# EAGLE design main (EAGLE 9.6.1)
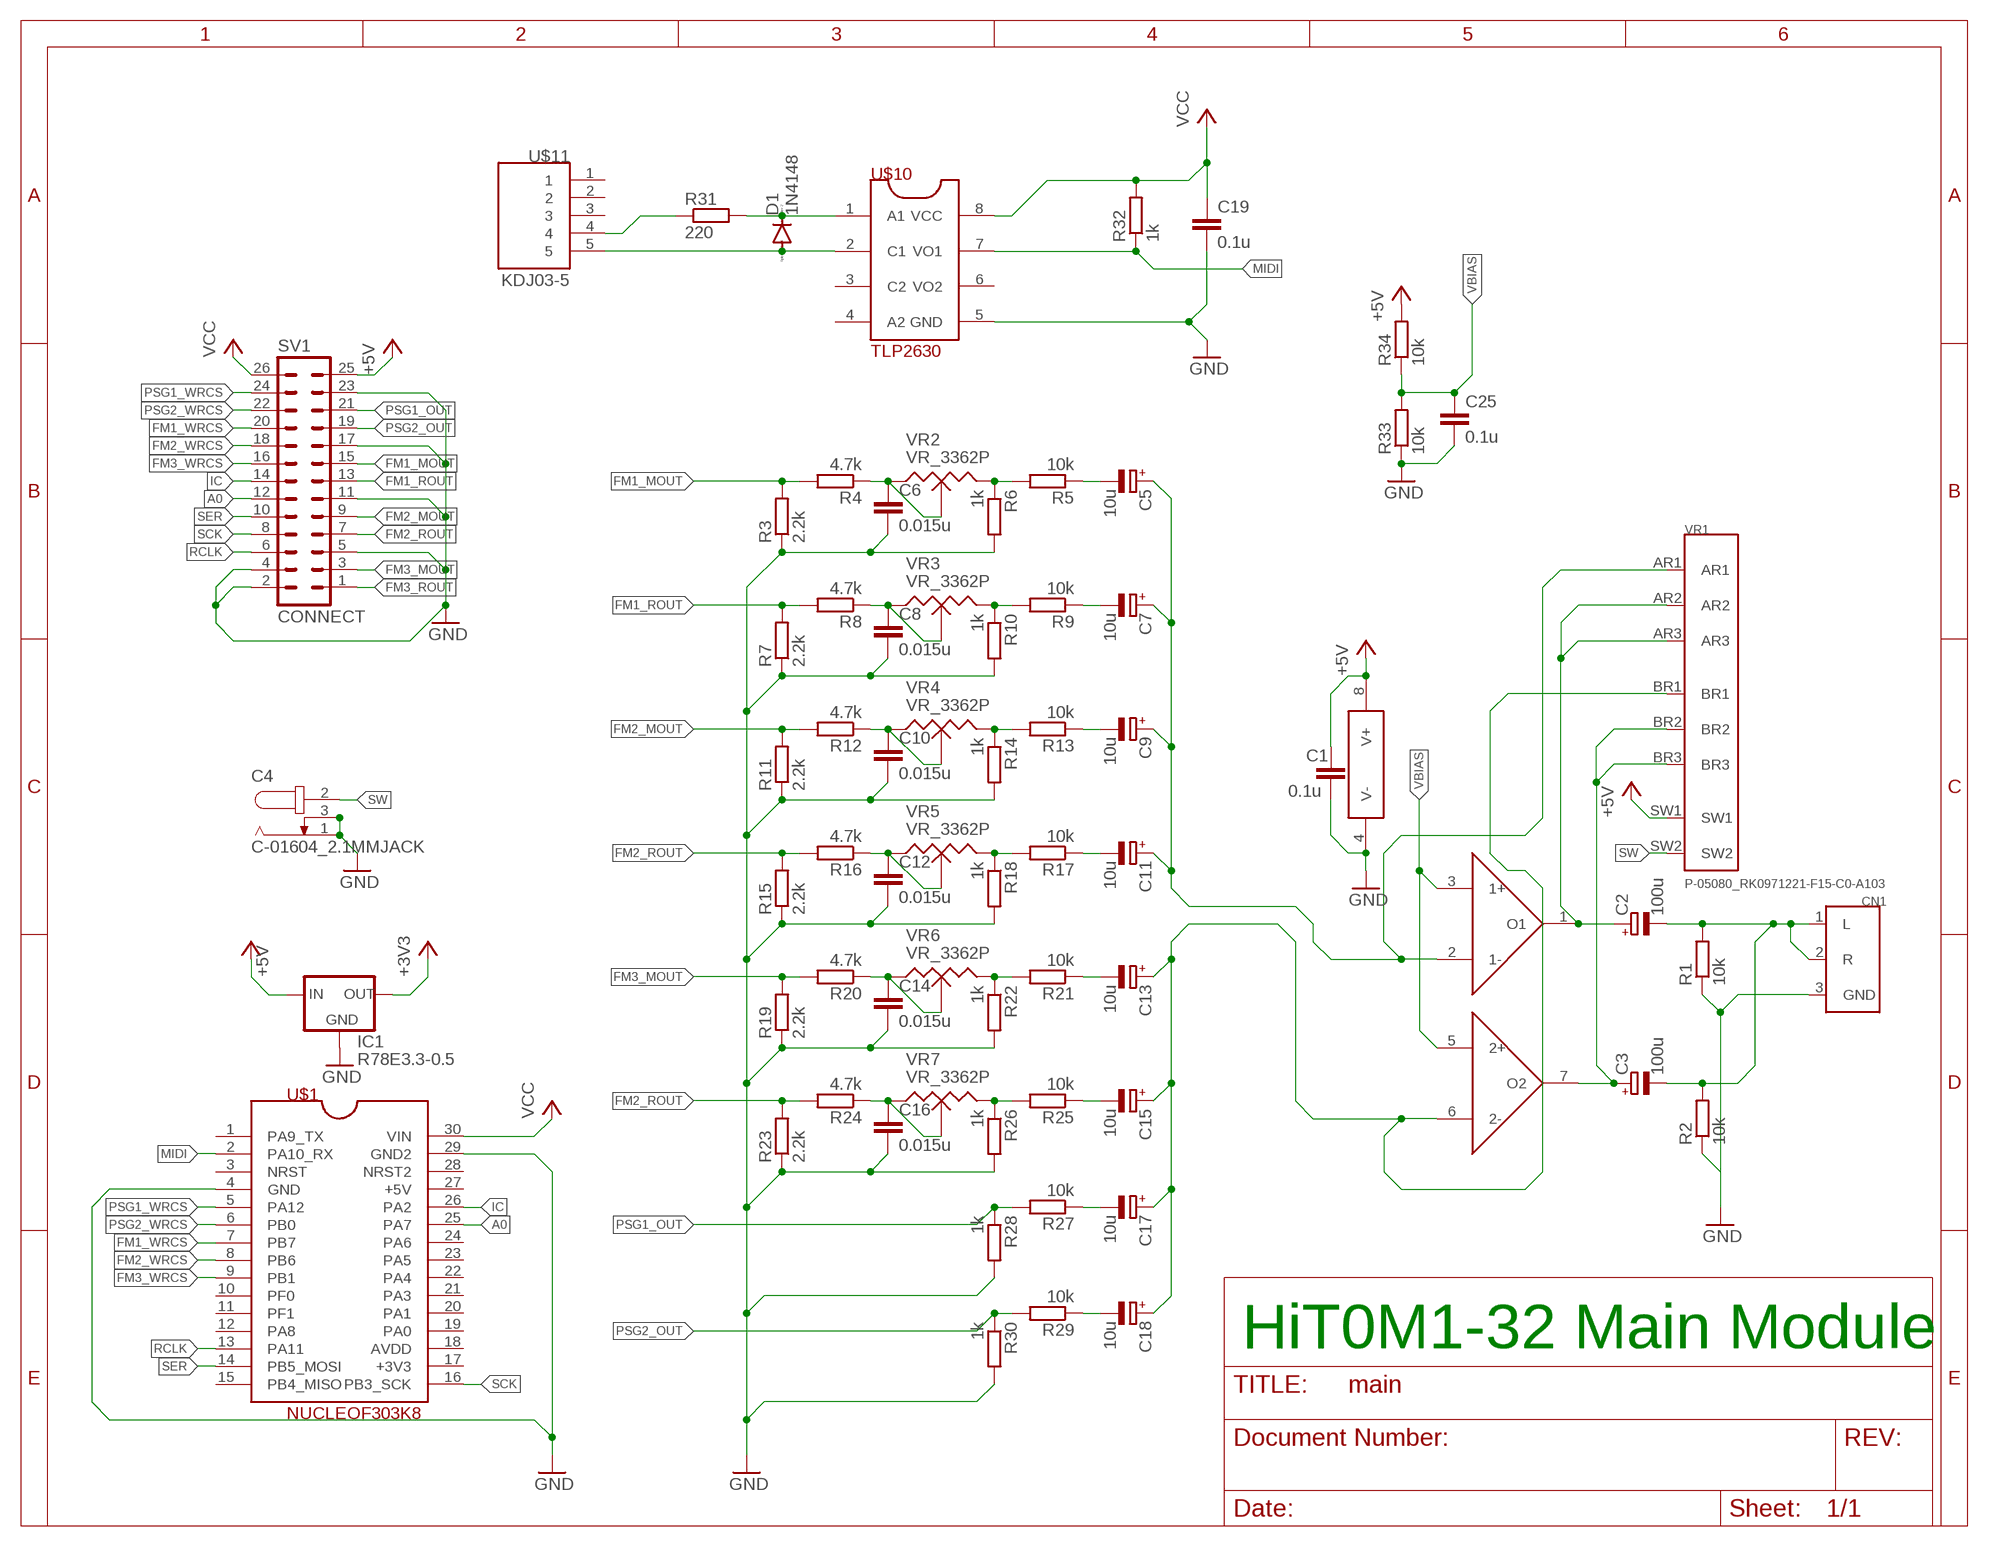
[diagram p0: schematic, sheet 1]

## Parts
C1  0.1u  C-EU025-025X050  [C025-025X050]
C2  100u  CPOL-EUE2,5-6E  [E2,5-6E]
C3  100u  CPOL-EUE2,5-6E  [E2,5-6E]
C4  C-01604_2.1MMJACK  [2.1MMJACK]
C5  10u  CPOL-EUE2,5-6E  [E2,5-6E]
C6  0.015u  C-EU050-025X075  [C050-025X075]
C7  10u  CPOL-EUE2,5-6E  [E2,5-6E]
C8  0.015u  C-EU050-025X075  [C050-025X075]
C9  10u  CPOL-EUE2,5-6E  [E2,5-6E]
C10  0.015u  C-EU050-025X075  [C050-025X075]
C11  10u  CPOL-EUE2,5-6E  [E2,5-6E]
C12  0.015u  C-EU050-025X075  [C050-025X075]
C13  10u  CPOL-EUE2,5-6E  [E2,5-6E]
C14  0.015u  C-EU050-025X075  [C050-025X075]
C15  10u  CPOL-EUE2,5-6E  [E2,5-6E]
C16  0.015u  C-EU050-025X075  [C050-025X075]
C17  10u  CPOL-EUE2,5-6E  [E2,5-6E]
C18  10u  CPOL-EUE2,5-6E  [E2,5-6E]
C19  0.1u  C-EU025-025X050  [C025-025X050]
C25  0.1u  C-EU025-025X050  [C025-025X050]
CN1  C-08958_MJ-352W-0  [MJ-352W-0]
D1  1N4148  1N4148DO35-7  [DO35-7]
IC1  R78E3.3-0.5  78XXS  [78XXS]
R1  10k  R-EU_0204/7  [0204/7]
R2  10k  R-EU_0204/7  [0204/7]
R3  2.2k  R-EU_0204/7  [0204/7]
R4  4.7k  R-EU_0204/7  [0204/7]
R5  10k  R-EU_0204/7  [0204/7]
R6  1k  R-EU_0204/7  [0204/7]
R7  2.2k  R-EU_0204/7  [0204/7]
R8  4.7k  R-EU_0204/7  [0204/7]
R9  10k  R-EU_0204/7  [0204/7]
R10  1k  R-EU_0204/7  [0204/7]
R11  2.2k  R-EU_0204/7  [0204/7]
R12  4.7k  R-EU_0204/7  [0204/7]
R13  10k  R-EU_0204/7  [0204/7]
R14  1k  R-EU_0204/7  [0204/7]
R15  2.2k  R-EU_0204/7  [0204/7]
R16  4.7k  R-EU_0204/7  [0204/7]
R17  10k  R-EU_0204/7  [0204/7]
R18  1k  R-EU_0204/7  [0204/7]
R19  2.2k  R-EU_0204/7  [0204/7]
R20  4.7k  R-EU_0204/7  [0204/7]
R21  10k  R-EU_0204/7  [0204/7]
R22  1k  R-EU_0204/7  [0204/7]
R23  2.2k  R-EU_0204/7  [0204/7]
R24  4.7k  R-EU_0204/7  [0204/7]
R25  10k  R-EU_0204/7  [0204/7]
R26  1k  R-EU_0204/7  [0204/7]
R27  10k  R-EU_0204/7  [0204/7]
R28  1k  R-EU_0204/7  [0204/7]
R29  10k  R-EU_0204/7  [0204/7]
R30  1k  R-EU_0204/7  [0204/7]
R31  220  R-EU_0204/7  [0204/7]
R32  1k  R-EU_0204/7  [0204/7]
R33  10k  R-EU_0204/7  [0204/7]
R34  10k  R-EU_0204/7  [0204/7]
SV1  CONNECT  MA13-2  [MA13-2]
U$1  NUCLEOF303K8  [NUCLEOF303K8]
U$2  NJM2114  [DIL08]
U$10  TLP2630  TLP2630TLP2630  [DIL08]
U$11  KDJ03-5  [KDJ03-5]
VR1  P-05080_RK0971221-F15-C0-A103  [RK0971221-F15-C0-A103]
VR2  VR_3362P  P-03277_VR_3362P  [VR_3362P]
VR3  VR_3362P  P-03277_VR_3362P  [VR_3362P]
VR4  VR_3362P  P-03277_VR_3362P  [VR_3362P]
VR5  VR_3362P  P-03277_VR_3362P  [VR_3362P]
VR6  VR_3362P  P-03277_VR_3362P  [VR_3362P]
VR7  VR_3362P  P-03277_VR_3362P  [VR_3362P]

## Nets
+3V3: IC1.OUT
+5V: C1.1 IC1.IN R34.2 SV1.25 U$2.8(V+) VR1.SW1
A0: SV1.12 U$1.25(PA7)
FM1_MOUT: R3.2 R4.2 SV1.15
FM1_ROUT: R7.2 R8.2 SV1.13
FM1_WRCS: SV1.20 U$1.7(PB7)
FM2_MOUT: R11.2 R12.2 SV1.9
FM2_ROUT: R15.2 R16.2 R23.2 R24.2 SV1.7
FM2_WRCS: SV1.18 U$1.8(PB6)
FM3_MOUT: R19.2 R20.2 SV1.3
FM3_ROUT: SV1.1
FM3_WRCS: SV1.16 U$1.9(PB1)
GND: C1.2 C4.1(GND) C4.3(S) C6.2 C8.2 C10.2 C12.2 C14.2 C16.2 C19.2 C25.2 CN1.3(GND) IC1.GND R1.1 R3.1 R6.2 R7.1 R10.2 R11.1 R14.2 R15.1 R18.2 R19.1 R22.2 R23.1 R26.2 R28.2 R30.2 R33.1 SV1.2 SV1.4 SV1.5 SV1.11 SV1.17 SV1.23 U$1.4(GND) U$1.29(GND2) U$2.4(V-) U$10.5(GND)
IC: SV1.14 U$1.26(PA2)
MIDI: R32.1 U$1.2(PA10_RX) U$10.7(VO1)
MIX_1: C5.+ C7.+ C9.+ C11.+ U$2.2(1-) VR1.AR1
MIX_2: C13.+ C15.+ C17.+ C18.+ U$2.6(2-) VR1.BR1
N$1: D1.C R31.2 U$10.1(A1)
N$3: C2.+ U$2.1(O1) VR1.AR2 VR1.AR3
N$4: R2.1
N$5: C3.+ U$2.7(O2) VR1.BR2 VR1.BR3
N$7: C8.1 R8.1 VR3.1 VR3.2
N$8: D1.A U$10.2(C1) U$11.5
N$11: C6.1 R4.1 VR2.1 VR2.2
N$12: R5.2 R6.1 VR2.3
N$13: C5.- R5.1
N$15: R9.2 R10.1 VR3.3
N$16: C7.- R9.1
N$19: C10.1 R12.1 VR4.1 VR4.2
N$20: R13.2 R14.1 VR4.3
N$21: C9.- R13.1
N$24: C12.1 R16.1 VR5.1 VR5.2
N$25: R17.2 R18.1 VR5.3
N$26: C11.- R17.1
N$29: C14.1 R20.1 VR6.1 VR6.2
N$30: R21.2 R22.1 VR6.3
N$31: C13.- R21.1
N$34: C16.1 R24.1 VR7.1 VR7.2
N$35: R25.2 R26.1 VR7.3
N$36: C15.- R25.1
N$40: C17.- R27.1
N$41: C18.- R29.1
N$43: R31.1 U$11.4
OUT: C2.- C3.- CN1.1(L) CN1.2(R) R1.2 R2.2
PSG1_OUT: R27.2 R28.1 SV1.21
PSG1_WRCS: SV1.24 U$1.5(PA12)
PSG2_OUT: R29.2 R30.1 SV1.19
PSG2_WRCS: SV1.22 U$1.6(PB0)
RCLK: SV1.6 U$1.13(PA11)
SCK: SV1.8 U$1.16(PB3_SCK)
SER: SV1.10 U$1.14(PB5_MOSI)
SW: C4.2(VCC) VR1.SW2
VBIAS: C25.1 R33.2 R34.1 U$2.3(1+) U$2.5(2+)
VCC: C19.1 R32.2 SV1.26 U$1.30(VIN) U$10.8(VCC)
Unconnected: U$1.1(PA9_TX) U$1.3(NRST) U$1.10(PF0) U$1.11(PF1) U$1.12(PA8) U$1.15(PB4_MISO) U$1.17(+3V3) U$1.18(AVDD) U$1.19(PA0) U$1.20(PA1) U$1.21(PA3) U$1.22(PA4) U$1.23(PA5) U$1.24(PA6) U$1.27(+5V) U$1.28(NRST2) U$10.3(C2) U$10.4(A2) U$10.6(VO2) U$11.1 U$11.2 U$11.3

## Notes on the sheet
- HiT0M1-32 Main Module

## Library data of the parts
C1 C6 C8 C10 C12 C14 C16 C19 C25 = rcl:C-EU: CAPACITOR, European symbol; SPICEPREFIX: C
C2 C3 C5 C7 C9 C11 C13 C15 C17 C18 = rcl:CPOL-EU: POLARIZED CAPACITOR, European symbol; SPICEPREFIX: C
C4 = Akizuki:C-01604_2.1MMJACK
CN1 = Akizuki:C-08958_MJ-352W-0
D1 = diode:1N4148: DIODE high speed (Philips)
IC1 = v-reg:78XXS: VOLTAGE REGULATOR
R1-R34 = rcl:R-EU_: RESISTOR, European symbol; SPICEPREFIX: R
SV1 = con-lstb:MA13-2: PIN HEADER; OC_FARNELL: unknown; OC_NEWARK: unknown
U$1 = midi:NUCLEOF303K8
U$2 = midi:NJM2114
U$10 = midi:TLP2630
U$11 = midi:KDJ03-5
VR1 = Akizuki:P-05080_RK0971221-F15-C0-A103
VR2-VR7 = Akizuki:P-03277_VR_3362P

## Net classes
0 default: width 1.143 mm, clearance 0.254 mm

## Board
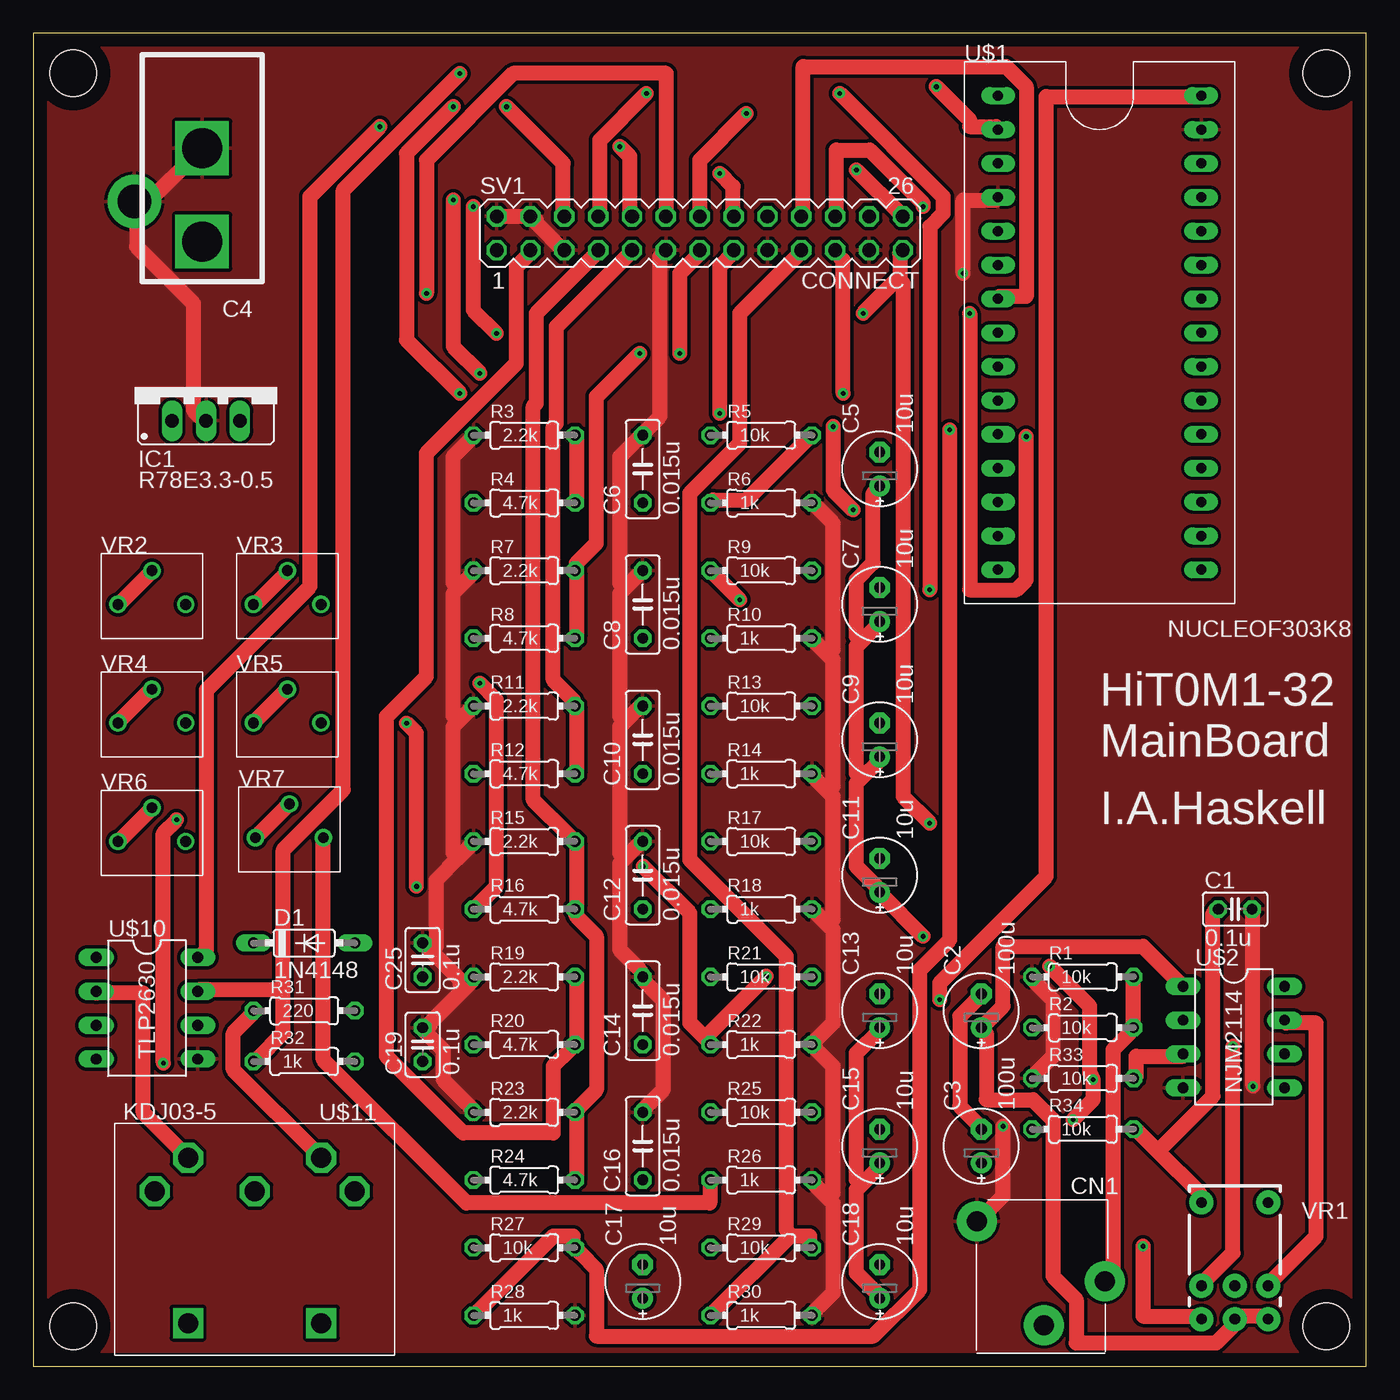
[diagram p1: board, top side]
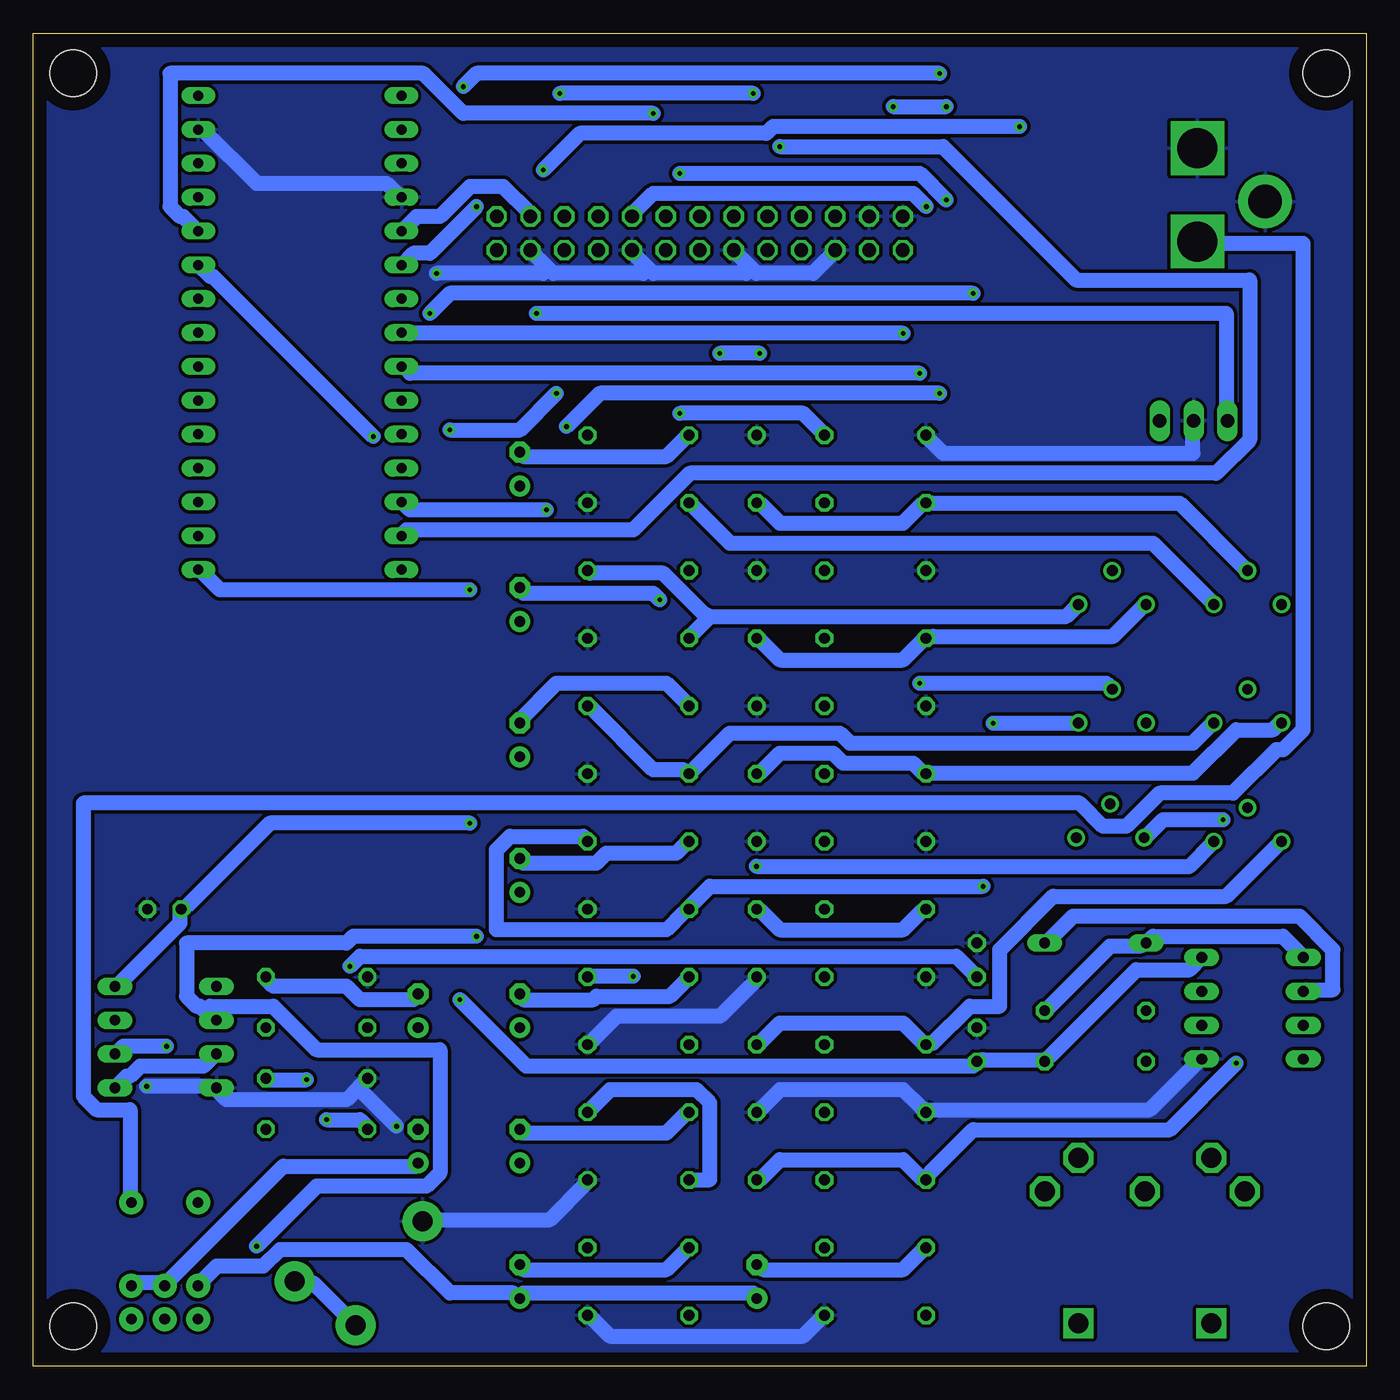
[diagram p2: board, bottom side, seen from below]

Size 100 x 100 mm. Coordinates in mm from the lower left corner, seen from the top.
Outline: 0,0 100,0 100,100 0,100 0,0
Copper layers (1*16): Top 0.035mm / dielectric 1.5mm / Bottom 0.035mm
Design rules "default": minimum track width 6mil, minimum drill 0.35mm, track to track 6mil, track to pad 6mil, pad to pad 6mil, via to via 6mil, smd to smd 6mil, copper to edge 40mil, drill to drill 6mil, minimum pad ring 10mil, minimum via ring 8mil, stop-mask expansion 4mil, vias tented up to drill 0mil, thermal gap 10mil
Holes 3.5 mm at 3,97 3,3 97,3 97,97

### Footprints (pad centres in the part's own frame; a part is rotated, then mirrored left to right if it is on the bottom)
C025-025X050 = drill 0.813 octagon: 1 -1.27,0; 2 1.27,0
E2,5-6E = drill 0.813 pad 1.575: + -1.27,0 | drill 0.813 pad 1.575 octagon: - 1.27,0
2.1MMJACK = drill 3 pad 3.3 square: 1 0,0; 2 0,7 | drill 2.5 pad 4: 3 5.082,4
C050-025X075 = drill 0.813 octagon: 1 -2.54,0; 2 2.54,0
MJ-352W-0 = drill 1.5 pad 3: 1 0,0; 2 4.55,3.3; 3 -5.05,7.8
DO35-7 = drill 0.813 long: A 3.81,0; C -3.81,0
78XXS = drill 1.016 long: GND 0,-2.54; IN -2.54,-2.54; OUT 2.54,-2.54
0204/7 = drill 0.813 octagon: 1 -3.81,0; 2 3.81,0
MA13-2 = drill 1.016 octagon: 1 -15.24,-1.27; 2 -15.24,1.27; 3 -12.7,-1.27; 4 -12.7,1.27; 5 -10.16,-1.27; 6 -10.16,1.27; 7 -7.62,-1.27; 8 -7.62,1.27; 9 -5.08,-1.27; 10 -5.08,1.27; 11 -2.54,-1.27; 12 -2.54,1.27; 13 0,-1.27; 14 0,1.27; 15 2.54,-1.27; 16 2.54,1.27; 17 5.08,-1.27; 18 5.08,1.27; 19 7.62,-1.27; 20 7.62,1.27; 21 10.16,-1.27; 22 10.16,1.27; 23 12.7,-1.27; 24 12.7,1.27; 25 15.24,-1.27; 26 15.24,1.27
NUCLEOF303K8 = drill 0.75 long: 1 -7.62,20.32; 2 -7.62,17.78; 3 -7.62,15.24; 4 -7.62,12.7; 5 -7.62,10.16; 6 -7.62,7.62; 7 -7.62,5.08; 8 -7.62,2.54; 9 -7.62,0; 10 -7.62,-2.54; 11 -7.62,-5.08; 12 -7.62,-7.62; 13 -7.62,-10.16; 14 -7.62,-12.7; 15 -7.62,-15.24; 16 7.62,-15.24; 17 7.62,-12.7; 18 7.62,-10.16; 19 7.62,-7.62; 20 7.62,-5.08; 21 7.62,-2.54; 22 7.62,0; 23 7.62,2.54; 24 7.62,5.08; 25 7.62,7.62; 26 7.62,10.16; 27 7.62,12.7; 28 7.62,15.24; 29 7.62,17.78; 30 7.62,20.32
DIL08 = drill 0.813 long: 1 -3.81,-3.81; 2 -1.27,-3.81; 3 1.27,-3.81; 4 3.81,-3.81; 5 3.81,3.81; 6 1.27,3.81; 7 -1.27,3.81; 8 -3.81,3.81
KDJ03-5 = drill 1.5 octagon: 1 -7.5,-9.9; 2 0,-9.9; 3 7.5,-9.9; 4 -5,-12.4; 5 5,-12.4 | drill 1.5 square: M1 -5,0; M2 5,0
RK0971221-F15-C0-A103 = drill 0.8 pad 1.8: AR1 -2.5,0; AR2 0,0; AR3 2.5,0; BR1 -2.5,2.5; BR2 0,2.5; BR3 2.5,2.5; SW1 -2.5,8.75; SW2 2.5,8.75
VR_3362P = drill 0.8: 1 0,0; 2 2.54,2.54; 3 5.08,0

### Placement (x,y rotation side)
C1  90.17,34.29 0 top
C2  71.12,26.67 90 top
C3  71.12,16.51 90 top
C4  12.66,91.38 180 top
C5  63.5,67.31 90 top
C6  45.72,67.31 90 top
C7  63.5,57.15 90 top
C8  45.72,57.15 90 top
C9  63.5,46.99 90 top
C10  45.72,46.99 90 top
C11  63.5,36.83 90 top
C12  45.72,36.83 90 top
C13  63.5,26.67 90 top
C14  45.72,26.67 90 top
C15  63.5,16.51 90 top
C16  45.72,16.51 90 top
C17  45.72,6.35 90 top
C18  63.5,6.35 90 top
C19  29.21,24.13 90 top
C25  29.21,30.48 90 top
CN1  75.83,3.08 0 top
D1  20.32,31.75 0 top
IC1  12.95,73.47 0 top
R1  78.74,29.21 0 top
R2  78.74,25.4 0 top
R3  36.83,69.85 0 top
R4  36.83,64.77 0 top
R5  54.61,69.85 0 top
R6  54.61,64.77 0 top
R7  36.83,59.69 0 top
R8  36.83,54.61 0 top
R9  54.61,59.69 0 top
R10  54.61,54.61 0 top
R11  36.83,49.53 0 top
R12  36.83,44.45 0 top
R13  54.61,49.53 0 top
R14  54.61,44.45 0 top
R15  36.83,39.37 0 top
R16  36.83,34.29 0 top
R17  54.61,39.37 0 top
R18  54.61,34.29 0 top
R19  36.83,29.21 0 top
R20  36.83,24.13 0 top
R21  54.61,29.21 0 top
R22  54.61,24.13 0 top
R23  36.83,19.05 0 top
R24  36.83,13.97 0 top
R25  54.61,19.05 0 top
R26  54.61,13.97 0 top
R27  36.83,8.89 0 top
R28  36.83,3.81 0 top
R29  54.61,8.89 0 top
R30  54.61,3.81 0 top
R31  20.32,26.67 0 top
R32  20.32,22.86 0 top
R33  78.74,21.59 0 top
R34  78.74,17.78 0 top
SV1  50,85 0 top
U$1  80,75 0 top
U$2  90.07,24.69 270 top
U$10  8.53,26.85 270 top
U$11  16.61,3.22 180 top
VR1  90.14,3.53 0 top
VR2  6.35,57.15 0 top
VR3  16.51,57.15 0 top
VR4  6.35,48.26 0 top
VR5  16.51,48.26 0 top
VR6  6.35,39.37 0 top
VR7  16.67,39.64 0 top

### Tracks (layer width: path | path; a pad name or v marks a point on that pad's centre or on a via)
+5V  (via drill 0.35)
  Top 1.143: 84.38,16.12 87.5,13 87.5,12.5 VR1.SW1 | 84.38,16.12 82.75,17.75 R34.2 | 84.38,16.12 88.5,20.25 88.5,34 88.75,34.25 C1.1 | 64.88,81.62 65,81.75 65,83.5 SV1.25 | 64.88,81.62 v62.25,79 | v67.25,40.75 65.25,42.75 65.25,81.25 64.88,81.62
  Bottom 1.143: U$2.8 93.75,28.5 89,33.25 89,34.25 C1.1 88.5,34.5 82.25,40.75 v67.25,40.75 | v62.25,79 10.5,79 10.5,71 IC1.IN
A0  (via drill 0.35)
  Top 1.143: v74.5,69.75 74.5,59 73.75,58.25 70.25,58.25 v70.25,79 | v29.5,80.5 29.5,90.5 36,97 47.5,97 47.5,86.5 SV1.12
  Bottom 1.143: U$1.25 86.75,81.75 86.5,81.75 v74.5,69.75 | v70.25,79 68.75,80.5 v29.5,80.5
FM1_MOUT  (via drill 0.35)
  Top 1.143: R4.2 40.75,65 40.75,69.75 R3.2 | v51.5,71.5 51.5,82.5 52.5,83.5 SV1.15
  Bottom 1.143: v51.5,71.5 42.25,71.5 40.75,70 R3.2
FM1_ROUT  (via drill 0.35)
  Top 1.143: R8.2 40.75,54.75 40.75,59.5 R7.2 40.75,60.25 42.25,61.75 42.25,72.75 v45.5,76 | v48.5,76 48.5,82 50,83.5 SV1.13
  Bottom 1.143: v45.5,76 v48.5,76
FM1_WRCS
  Top 1.143: U$1.7 72.5,80.25 74.5,80.25 74.5,96 73,97.5 57.75,97.5 57.75,86.5 SV1.20
FM2_MOUT
  Top 1.143: R12.2 40.75,44.5 40.75,49.5 R11.2 40.5,50 39,51.5 39,70.5 39.25,70.75 39.25,78 44.75,83.5 SV1.9
FM2_ROUT
  Top 1.143: R24.2 40.75,14 40.75,19 R23.2 41,19.5 42.25,20.75 42.25,32.25 40.75,33.75 R16.2 40.75,34.5 40.75,39.25 R15.2 40.25,39.75 37.5,42.5 37.5,72 37.75,72.25 37.75,79 42.25,83.5 SV1.7
FM2_WRCS  (via drill 0.35)
  Top 1.143: v34.75,77.5 33,79.25 v33,87
  Bottom 1.143: v34.75,77.5 72.25,77.5 U$1.8 | v33,87 34,88 53.5,88 55,86.5 SV1.18
FM3_MOUT
  Top 1.143: R19.2 40.75,29 40.75,24.25 R20.2 40.25,23.75 39,22.5 39,17.5 32.25,17.5 26.5,23.25 26.5,48.75 29.5,51.75 29.5,68.5 36.25,75.25 36.25,82.5 37.25,83.5 SV1.3
FM3_WRCS  (via drill 0.35)
  Top 1.143: v33.5,74.5 31.5,76.5 v31.5,87.5 | v51.5,89.5 52.5,88.5 52.5,86.5 SV1.16
  Bottom 1.143: v33.5,74.5 71.75,74.5 72.25,75 U$1.9 | v31.5,87.5 33.5,89.5 v51.5,89.5
GND  (via drill 0.35)
  Top 1.143: 59.62,33.12 58.5,34.25 R18.2 | 59.62,33.12 60,32.75 60,25.75 58.5,24.25 R22.2 58.75,23.75 60,22.5 60,13 59.62,12.62 | 59.62,43.12 60,42.75 60,33.5 59.62,33.12 | 59.62,43.12 58.5,44.25 R14.2 | 59.62,53.38 60,53 60,43.5 59.62,43.12 | 59.62,53.38 58.5,54.5 R10.2 | R6.2 58.5,64.75 60,63.25 60,53.75 59.62,53.38 | R33.1 75,21.75 76.5,23.25 76.5,27.5 75,29 R1.1 | v91.5,21 91.5,34.25 C1.2 | 59.62,12.62 58.5,13.75 R26.2 | 59.62,12.62 60,12.25 60,5.5 58.5,4 R30.2 | v72.75,18 72.75,12.75 71,11 CN1.3 | SV1.2 35,86.25 37.25,86.25 SV1.4 37.75,86 37.75,85.75 39.75,83.75 SV1.5 | v69.75,82 69.75,87.5 72.25,87.5 U$1.4 | C16.2 45.75,19.25 47.25,20.75 47.25,27.5 45.75,29 C14.2 45.5,29.75 44,31.25 44,37.75 44.38,38.12 | 44.38,38.12 45.5,39.25 C12.2 | 44.38,48.38 44,48 44,38.5 44.38,38.12 | 44.38,48.38 45.5,49.5 C10.2 | 44.38,58.38 44,58 44,48.75 44.38,48.38 | 44.38,58.38 45.5,59.5 C8.2 | 44.38,58.38 44,58.75 44,68.25 45.5,69.75 C6.2 46,70.25 47,71.25 47,83.25 47.25,83.5 SV1.11 | IC1.GND 12.75,71 12,71.75 12,79.75 7.75,84 7.75,87.25 C4.3 8.25,87 12.5,91.25 C4.1 | R23.1 33,19.25 30.75,21.5 30.75,23.75 29.25,25.25 C19.2 29.75,25.5 29.75,25.75 32.38,28.38 | 32.38,28.38 33,29 R19.1 | 29.88,31.12 32,29 32,28.75 32.38,28.38 | 29.88,31.12 29.25,31.75 C25.2 | 31.88,38.12 30.25,36.5 30.25,31.5 29.88,31.12 | 31.88,38.12 33,39.25 R15.1 | 31.88,48.38 31.5,48 31.5,38.5 31.88,38.12 | 31.88,48.38 33,49.5 R11.1 | 31.88,58.38 31.5,58 31.5,48.75 31.88,48.38 | 31.88,58.38 33,59.5 R7.1 | R3.1 33,69.75 31.5,68.25 31.5,58.75 31.88,58.38
  Bottom 1.143: 75.62,20.88 75,21.5 R33.1 | 75.62,20.88 76.5,20 85.5,20 86.25,20.75 U$2.4 86.75,21 v91.5,21 | R28.2 40.75,3.75 42.25,2.25 56.75,2.25 58.25,3.75 R30.2 | R26.2 58.5,13.75 61.25,11 70.75,11 CN1.3 | v72.75,18 75.62,20.88 | U$1.4 72.5,87.75 73.5,88.75 83.25,88.75 87.25,92.75 87.5,92.75 U$1.29 | 46.12,82.38 45.75,82 41.5,82 40,83.5 SV1.5 | 46.12,82.38 47.25,83.5 SV1.11 | 53.88,82.38 53.5,82 46.5,82 46.12,82.38 | 53.88,82.38 55,83.5 SV1.17 | 61.38,82.38 61,82 54.25,82 53.88,82.38 | 61.38,82.38 62.5,83.5 SV1.23 | v69.75,82 61.75,82 61.38,82.38 | U$10.5 12.5,23 16.25,19.25 33,19.25 R23.1 33.5,19.5 34.75,20.75 44,20.75 45.5,19.25 C16.2 | IC1.GND 13,70.75 13,68.5 31.75,68.5 33,69.75 R3.1 | R22.2 58.25,24.25 56.25,26.25 48.5,26.25 45.75,29 C14.2
  pour Top: 0,0 0,100.33 100.33,100.33 100.33,0
  pour Bottom: 0,0 0,100.33 100.33,100.33 100.33,0
IC  (via drill 0.35)
  Top 1.143: v53.5,94 50,90.5 SV1.14
  Bottom 1.143: v53.5,94 67.75,94 70.75,97 89.75,97 89.75,87 89,86.25 88.75,86.25 87.75,85.25 U$1.26
MIDI  (via drill 0.35)
  Top 1.143: v67.75,96 70.25,93.5 70.25,93 72.25,93 U$1.2 | v32,97 23.25,88.25 23.25,43.25 18.75,38.75 18.75,28.25 | 18.75,28.25 18.75,25 16.75,23 R32.1 | 18.75,28.25 12.5,28.25 U$10.7
  Bottom 1.143: v67.75,96 66.75,97 v32,97
MIX_1  (via drill 0.35)
  Top 1.143: v66.75,32.25 63.5,35.5 C11.+ 63.25,36 61.75,37.5 61.75,43.75 62.12,44.12 | 62.12,44.12 63.5,45.5 C9.+ | 62.12,54.38 61.75,54 61.75,44.5 62.12,44.12 | 62.12,54.38 63.5,55.75 C7.+ | C5.+ 63.5,66 63,65.5 63,60.25 61.75,59 61.75,54.75 62.12,54.38 | v83.25,9 83.25,3.75 87.5,3.75 VR1.AR1
  Bottom 1.143: 87.12,26.62 87.5,27 87.75,27 88.5,27.75 88.5,31.75 76.5,31.75 76,32.25 v66.75,32.25 | 87.12,26.62 86.5,26 U$2.2 | v83.25,9 78.75,13.5 70.5,13.5 69.5,14.5 69.5,23.75 78.75,23.75 82,27 86.75,27 87.12,26.62
MIX_2  (via drill 0.35)
  Top 1.143: v90,24 90,8.5 87.75,6.25 VR1.BR1 | 62.12,13.62 61.75,13.25 61.75,7 63.5,5.25 C18.+ | 62.12,13.62 63.5,15 C15.+ | C13.+ 63.5,25.25 61.75,23.5 61.75,14 62.12,13.62
  Bottom 1.143: v90,24 93.25,24 93.75,23.5 U$2.6 | C17.+ 45.75,5.25 46,5.5 63.25,5.5 63.5,5.25 C18.+ 64,5.5 68.75,5.5 72,8.75 81.5,8.75 82.75,7.5 86.25,7.5 87.5,6.25 VR1.BR1
N$1
  Bottom 1.143: U$10.1 4.75,30.75 6.25,32.25 16,32.25 D1.C 17,31.5 19.25,31.5 24,26.75 R31.2
N$3
  Top 1.143: VR1.AR3 92.5,3.75 90.25,3.75 VR1.AR2 90,3 88.75,1.75 78.25,1.75 78.25,5 76.5,6.75 76.5,18.5 75,20 71.5,20 71.5,25 C2.+ 71.25,25.5 72.75,27 72.75,31.5 83.25,31.5 U$2.1
N$5
  Top 1.143: U$2.7 94,25.75 96.25,25.75 96.25,9.75 92.75,6.25 VR1.BR3
  Bottom 1.143: C3.+ 71.25,15 81.25,15 90,6.25 VR1.BR2 90.5,6.25 92.5,6.25 VR1.BR3
N$7
  Top 1.143: VR3.1 16.75,57.25 19,59.5 VR3.2
  Bottom 1.143: C8.1 45.5,54.5 44,53 34.75,53 33.25,54.5 R8.1 32.5,54.75 19,54.75 16.75,57 VR3.1
N$8
  Top 1.143: U$10.2 4.75,28 8.25,28 8.25,19 11.5,15.75 U$11.5
  Bottom 1.143: D1.A 24,31.75 22,33.75 5,33.75 2.5,31.25 2.5,28.25 4.5,28.25 U$10.2
N$11
  Top 1.143: VR2.1 6.5,57.25 8.75,59.5 VR2.2
  Bottom 1.143: C6.1 45.5,64.75 44,63.25 34.75,63.25 33.25,64.75 R4.1 32.5,64.75 14,64.75 9,59.75 VR2.2
N$12
  Top 1.143: R5.2 58.25,69.75 53.5,65 51,65 R6.1
  Bottom 1.143: VR2.3 11.5,57.25 16,61.75 47.75,61.75 50.75,64.75 R6.1
N$13
  Bottom 1.143: R5.1 51,69.75 52.5,68.25 63.25,68.25 63.5,68.5 C5.-
N$15
  Bottom 1.143: 49.25,56.25 22.5,56.25 21.75,57 VR3.3 | 49.25,56.25 50.75,54.75 R10.1 | R9.2 58.25,59.5 52.75,59.5 49.75,56.5 49.25,56.25
N$16  (via drill 0.35)
  Top 1.143: v53,57.5 51,59.5 R9.1
  Bottom 1.143: v53,57.5 53.5,58 63.25,58 63.5,58.25 C7.-
N$19
  Top 1.143: VR4.1 6.5,48.5 8.75,50.75 VR4.2
  Bottom 1.143: C10.1 45.5,44.5 44,46 40,46 39.25,45.25 34,45.25 33.25,44.5 R12.1 32.5,44.5 13,44.5 9.75,47.75 7,47.75 6.5,48.25 VR4.1
N$20
  Bottom 1.143: VR4.3 11.5,48.25 13,46.75 38.75,46.75 39.5,47.5 47.75,47.5 R14.1 51.25,44.75 53.5,44.75 58.25,49.5 R13.2
N$21
  Bottom 1.143: R13.1 51,49.75 52.5,51.25 60.75,51.25 63.5,48.5 C9.-
N$24  (via drill 0.35)
  Top 1.143: VR5.2 VR5.1 | v33.5,51.25 34.75,50 34.75,36 33.25,34.5 R16.1
  Bottom 1.143: R16.1 33.25,34.25 34.75,32.75 44,32.75 45.5,34.25 C12.1 | VR5.2 19.5,51.25 v33.5,51.25
N$25  (via drill 0.35)
  Top 1.143: v28,48.25 28.75,47.5 v28.75,36
  Bottom 1.143: v28,48.25 21.75,48.25 VR5.3 | v28.75,36 49.25,36 50.75,34.5 R18.1 51.25,34 52.5,32.75 65.25,32.75 65.25,38.75 64.25,39.75 58.75,39.75 58.5,39.5 R17.2
N$26
  Bottom 1.143: R17.1 51,39.25 51.75,38.5 57,38.5 57.75,37.75 63.25,37.75 63.5,38 C11.-
N$29
  Top 1.143: VR6.1 6.5,39.5 8.75,41.75 VR6.2
  Bottom 1.143: C14.1 45.5,24.25 44,25.75 34.75,25.75 33.25,24.25 R20.1 32.5,24.25 29.75,27 27.5,27 27.5,31.25 23.5,35.25 10.5,35.25 6.5,39.25 VR6.1
N$30  (via drill 0.35)
  Top 1.143: v45.75,37.5 49.25,34 49.25,25.75 50.38,24.62 | 50.38,24.62 50.75,24.25 R22.1 | 50.38,24.62 v55,29.25
  Bottom 1.143: v45.75,37.5 13.25,37.5 11.5,39.25 VR6.3 | v55,29.25 58.25,29.25 R21.2
N$31
  Bottom 1.143: R21.1 51,29 52.25,27.75 57.75,27.75 58,27.5 63.25,27.5 63.5,27.75 C13.-
N$34  (via drill 0.35)
  Top 1.143: VR7.1 16.75,39.75 19,42 VR7.2 | v10.75,41 9.75,40 v9.75,22.75
  Bottom 1.143: C16.1 45.5,14 44,15.5 34.75,15.5 33.25,14 R24.1 32.75,14.5 29.5,17.75 14.75,17.75 v9.75,22.75 | v10.75,41 15.25,41 16.5,39.75 VR7.1
N$35
  Top 1.143: VR7.3 21.75,23 32.5,12.25 50.75,12.25 50.75,13.75 R26.1
  Bottom 1.143: R25.2 58.25,19.25 56.75,20.75 50.25,20.75 49.25,19.75 49.25,14 50.75,14 R26.1
N$36
  Bottom 1.143: R25.1 51,19 52.5,17.5 63.25,17.5 63.5,17.75 C15.-
N$40
  Bottom 1.143: R27.1 33.25,8.75 34.75,7.25 45.25,7.25 45.5,7.5 C17.-
N$41
  Bottom 1.143: R29.1 51,8.75 52.5,7.25 63.25,7.25 63.5,7.5 C18.-
N$43
  Top 1.143: R31.1 16.5,26.5 15,25 15,22.25 21.5,15.75 U$11.4
OUT
  Top 1.143: R1.2 82.5,29 82.5,25.5 R2.2 82.25,25 81,23.75 81,7 CN1.2 | C3.- 71,18 69.5,19.5 69.5,26.25 71,27.75 C2.-
  Bottom 1.143: CN1.1 79,6.25 80.25,6.25 CN1.2 | R1.2 82.5,29 82,28.5 76.5,28.5 75.5,27.5 71.5,27.5 71.25,27.75 C2.-
PSG1_OUT  (via drill 0.35)
  Top 1.143: R28.1 33.25,4 39,9.75 40.5,9.75 40.5,9 R27.2 41,8.5 42.25,7.25 42.25,2.25 63,2.25 66.5,5.75 66.5,29.75 68.75,32 v68.75,70.25 | v60.75,73 60.75,83 60.25,83.5 SV1.21
  Bottom 1.143: v60.75,73 63.5,70.25 v68.75,70.25
PSG1_WRCS
  Bottom 1.143: U$1.5 72.25,85.25 71.25,86.25 69.5,86.25 67.25,88.5 64.75,88.5 62.75,86.5 SV1.24
PSG2_OUT
  Top 1.143: 56.75,9.75 51,4 R30.1 | 56.75,9.75 58.25,9.75 58.25,9 R29.2 | SV1.19 57.5,83.5 53,79 53,69.25 49.25,65.5 49.25,38 56.5,30.75 56.5,10.25 56.75,9.75
PSG2_WRCS  (via drill 0.35)
  Top 1.143: v66.75,87 66.75,87.25 62.75,91.25 60.25,91.25 60.25,86.5 SV1.22
  Bottom 1.143: U$1.6 71.5,83.5 70.25,83.5 v66.75,87
RCLK  (via drill 0.35)
  Top 1.143: v61.5,64.25 60,65.75 v60,70.5 | v32,73 28,77 28,91 v31.5,94.5 | v35.5,94.5 39.75,90.25 39.75,86.5 SV1.6
  Bottom 1.143: v61.5,64.25 71.75,64.25 72.25,64.75 U$1.13 | v60,70.5 57.5,73 v32,73 | v35.5,94.5 v31.5,94.5
SCK  (via drill 0.35)
  Top 1.143: v67.25,58.25 67.25,85.5 68.25,86.5 68.25,87.75 v60.5,95.5 | v46,95.5 42.5,92 42.5,86.5 SV1.8
  Bottom 1.143: v67.25,58.25 86,58.25 87.5,59.75 U$1.16 | v46,95.5 v60.5,95.5
SER  (via drill 0.35)
  Top 1.143: v44,91.5 44.75,90.75 44.75,86.5 SV1.10
  Bottom 1.143: v44,91.5 31.75,91.5 21.75,81.5 8.75,81.5 8.75,69.5 11.25,67 50.75,67 55,62.75 72,62.75 72.25,62.5 U$1.14
SW
  Bottom 1.143: VR1.SW2 92.75,12.5 92.75,19.25 95.25,19.25 96.25,20.25 96.25,42.25 21.5,42.25 19.75,40.5 18,40.5 15.5,43 10,43 6.75,46.25 6.25,46.25 4.75,47.75 4.75,84.25 12.5,84.25 C4.2
VBIAS  (via drill 0.35)
  Top 1.143: v78,18.5 79.5,20 v79.5,21.5 79.25,22 79.25,27 v76.25,30 | U$2.3 86.25,23.25 82.75,23.25 82.75,21.75 R33.2
  Bottom 1.143: v78,18.5 75.5,18.5 75,18 R34.1 | v79.5,21.5 82.5,21.5 R33.2 | C25.1 30.75,30.75 75.5,30.75 v76.25,30 | U$2.5 93.75,21 93,21.75 92.75,21.75 92,22.5 87.25,22.5 86.5,23.25 U$2.3
VCC  (via drill 0.35)
  Top 1.143: v68,27.5 68,28.75 76,36.75 76,95.25 87.5,95.25 U$1.30 | v61.75,89.75 65,86.5 SV1.26 | v26,93 20.75,87.75 20.75,58.5 13,50.75 13,31.25 12.5,30.75 U$10.8
  Bottom 1.143: v68,27.5 63,22.5 29.5,22.5 29.25,22.75 C19.1 28.75,23 24.25,23 R32.2 23.75,23.25 17.25,29.75 13.25,29.75 U$10.8 | v61.75,89.75 59,92.5 45,92.5 44.5,93 v26,93

### Text on the board
tPlace: HiT0M1-32 / MainBoard | I.A.Haskell